# Altium project EvvGC v1.2.PrjPcb
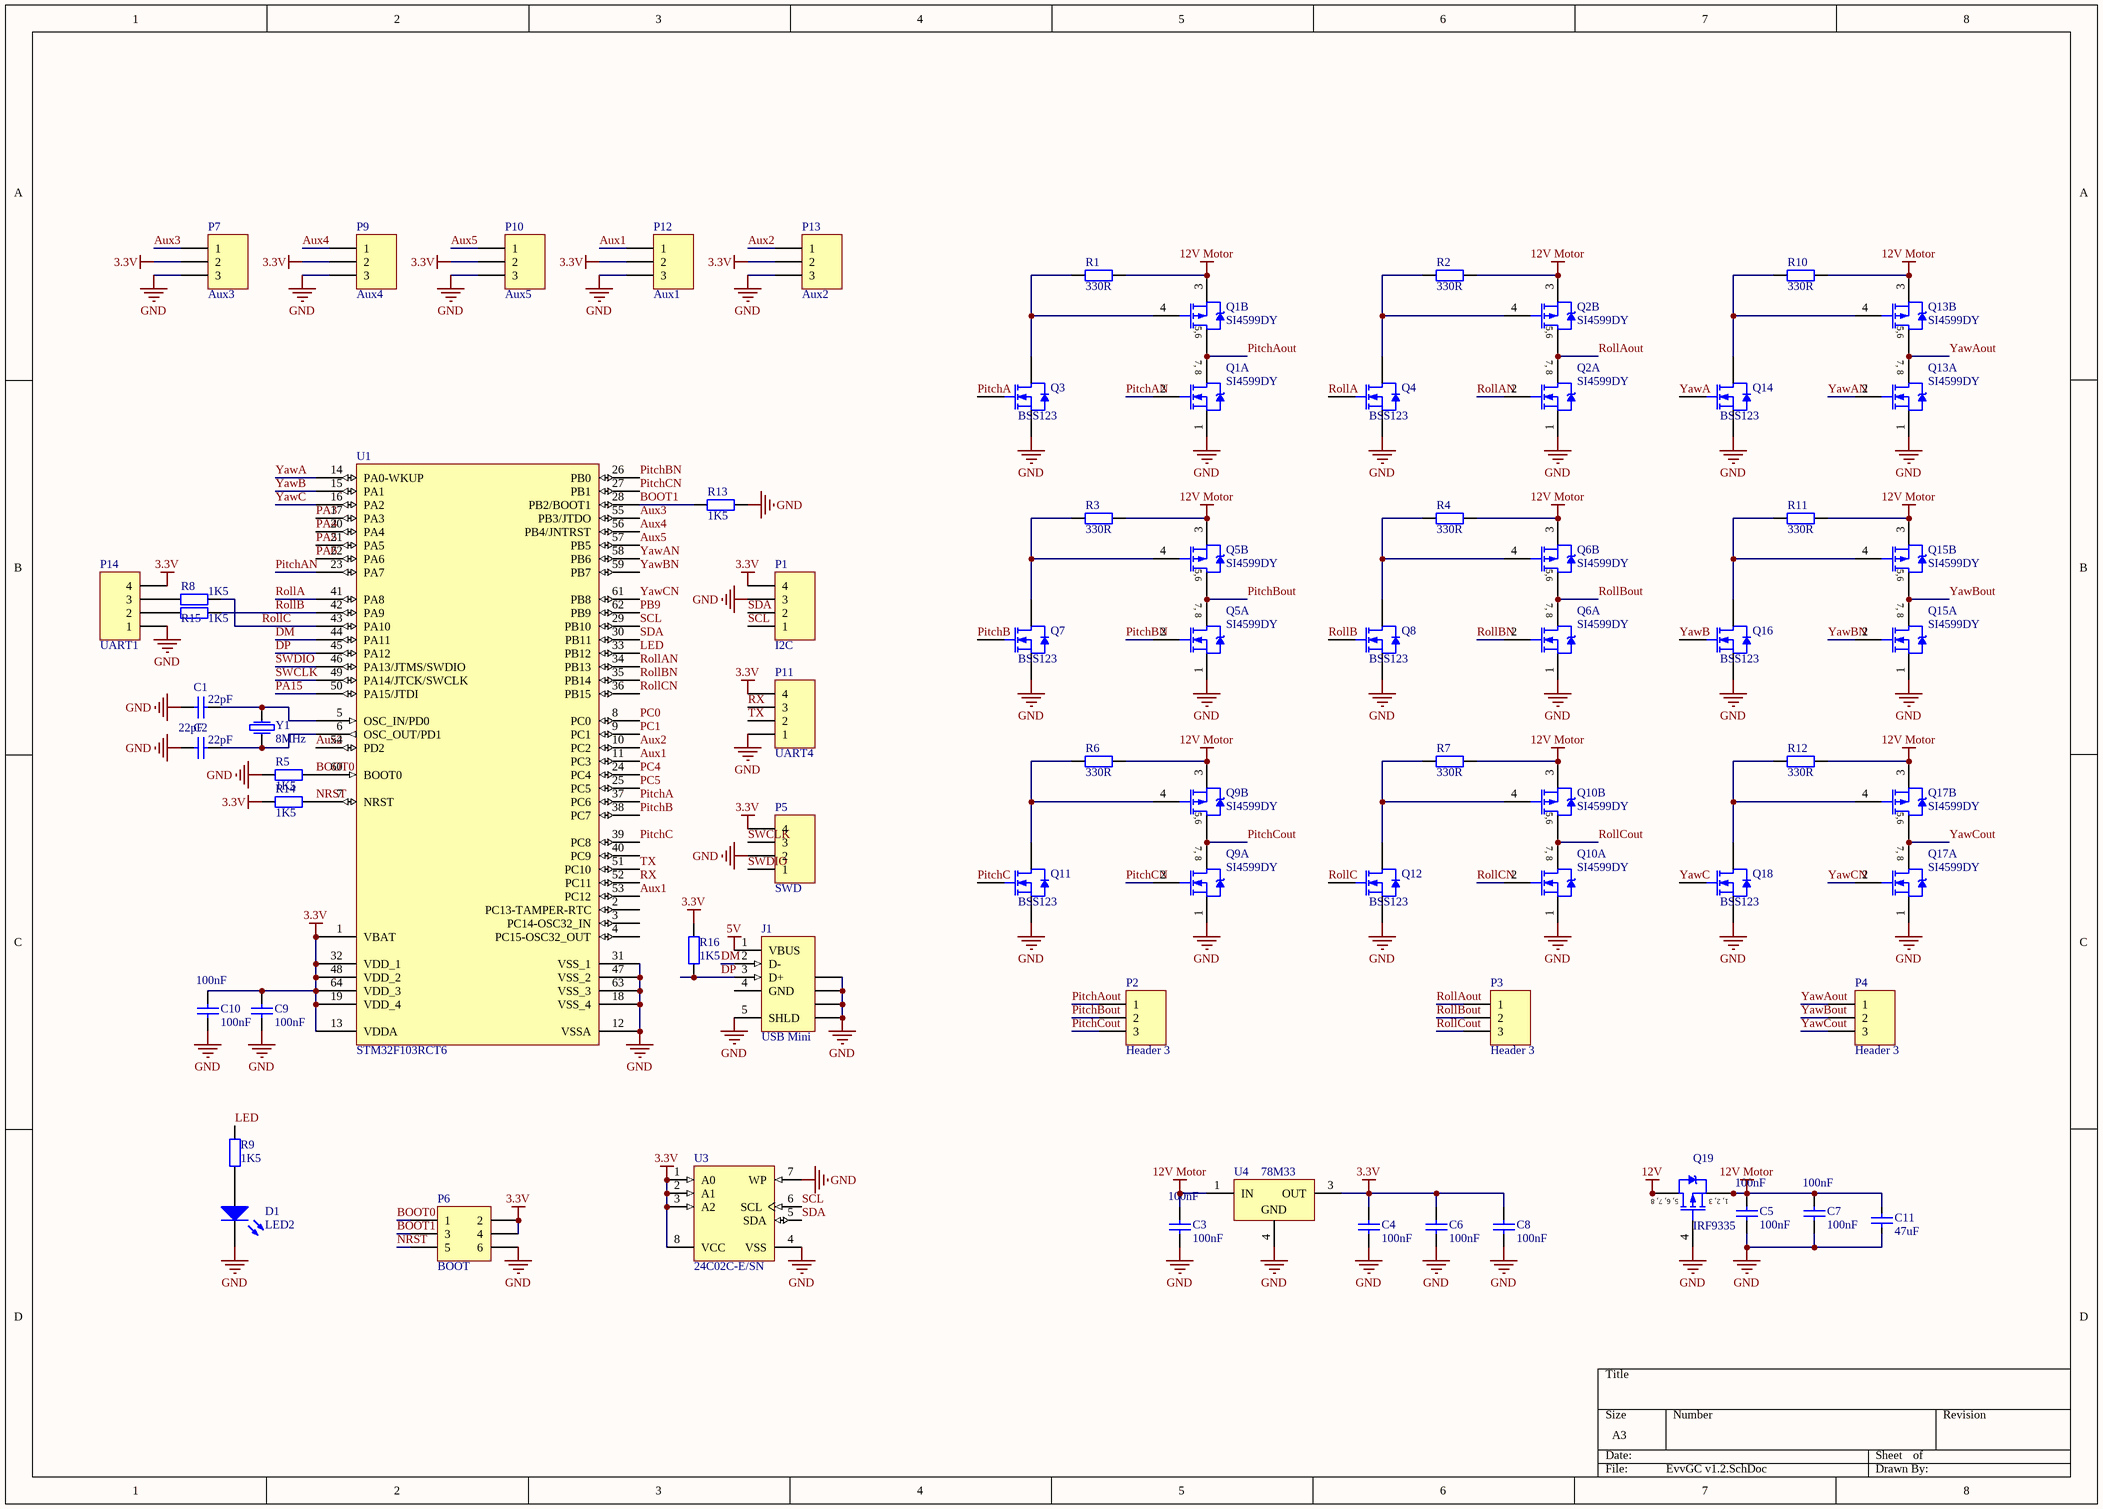
[diagram p0: EvvGC v1.2.SchDoc]
1 sheet, 65 parts. Net scope: global (net labels, ports and power ports of the same name join across sheets).
Board file: EvvGC v1.2.PcbDoc

## Sheet EvvGC v1.2.SchDoc
size A3

### Parts
C1  22pF  [CAPC2012L]
C2  22pF  [CAPC2012L]
C3  100nF  [CAPC2012L]
C4  100nF  [CAPC2012L]
C5  100nF  [CAPC2012L]
C6  100nF  [CAPC2012L]
C7  100nF  [CAPC2012L]
C8  100nF  [CAPC2012L]
C9  100nF  [CAPC2012L]
C10  100nF  [CAPC2012L]
C11  47uF  [TC6032-2412]
D1  LED2  [CAPC2012L]
J1  USB Mini  [440247]
P1  I2C  [HDR1X4]
P2  Header 3  [HDR1X3]
P3  Header 3  [HDR1X3]
P4  Header 3  [HDR1X3]
P5  SWD  [HDR1X4]
P6  BOOT  [HDR2X3]
P7  Aux3  [HDR1X3]
P9  Aux4  [HDR1X3]
P10  Aux5  [HDR1X3]
P11  UART4  [HDR1X4]
P12  Aux1  [HDR1X3]
P13  Aux2  [HDR1X3]
P14  UART1  [HDR1X4]
Q1  SI4599DY  [SO-8_N]  (parts A,B of 2)
Q2  SI4599DY  [SO-8_N]  (parts A,B of 2)
Q3  BSS123  [SOT23_N_EM]
Q4  BSS123  [SOT23_N_EM]
Q5  SI4599DY  [SO-8_N]  (parts A,B of 2)
Q6  SI4599DY  [SO-8_N]  (parts A,B of 2)
Q7  BSS123  [SOT23_N_EM]
Q8  BSS123  [SOT23_N_EM]
Q9  SI4599DY  [SO-8_N]  (parts A,B of 2)
Q10  SI4599DY  [SO-8_N]  (parts A,B of 2)
Q11  BSS123  [SOT23_N_EM]
Q12  BSS123  [SOT23_N_EM]
Q13  SI4599DY  [SO-8_N]  (parts A,B of 2)
Q14  BSS123  [SOT23_N_EM]
Q15  SI4599DY  [SO-8_N]  (parts A,B of 2)
Q16  BSS123  [SOT23_N_EM]
Q17  SI4599DY  [SO-8_N]  (parts A,B of 2)
Q18  BSS123  [SOT23_N_EM]
Q19  IRF9335  [SO-8_N]
R1  330R  [C0805]
R2  330R  [C0805]
R3  330R  [C0805]
R4  330R  [C0805]
R5  1K5  [RESC1608N]
R6  330R  [C0805]
R7  330R  [C0805]
R8  1K5  [RESC1608N]
R9  1K5  [RESC1608N]
R10  330R  [C0805]
R11  330R  [C0805]
R12  330R  [C0805]
R13  1K5  [RESC1608N]
R14  1K5  [RESC1608N]
R15  1K5  [RESC1608N]
R16  1K5  [RESC1608N]
U1  STM32F103RCT6  [LQFP64_N]
U3  24C02C-E/SN  [SOIC-SN8_N]
U4  78M33  [TO-252]
Y1  8MHz  [ABM3]

### Nets
3.3V: C4.1 C6.1 C8.1 C9.1 C10.1 P1.4 P5.4 P6.2 P6.4 P7.2 P9.2 P10.2 P11.4 P12.2 P13.2 P14.4 R14.2 R16.1 U1.1(VBAT) U1.13(VDDA) U1.19(VDD_4) U1.32(VDD_1) U1.48(VDD_2) U1.64(VDD_3) U3.1(A0) U3.2(A1) U3.3(A2) U3.8(VCC) U4.3(OUT)
5V: J1.1(VBUS)
12V: Q19.5(D) Q19.6(D) Q19.7(D) Q19.8(D)
12V Motor: C3.1 C5.1 C7.1 C11.2 Q1.3(S2) Q2.3(S2) Q5.3(S2) Q6.3(S2) Q9.3(S2) Q10.3(S2) Q13.3(S2) Q15.3(S2) Q17.3(S2) Q19.1(S) Q19.2(S) Q19.3(S) R1.2 R2.2 R3.2 R4.2 R6.2 R7.2 R10.2 R11.2 R12.2 U4.1(IN)
GND: C1.2 C2.2 C3.2 C4.2 C5.2 C6.2 C7.2 C8.2 C9.2 C10.2 C11.1 D1.2(K) J1.5(SHLD) J1.6(SHLD) J1.7(SHLD) J1.8(SHLD) J1.9(SHLD) P1.3 P5.2 P6.6 P7.3 P9.3 P10.3 P11.1 P12.3 P13.3 P14.1 Q1.1(S1) Q2.1(S1) Q3.2(S) Q4.2(S) Q5.1(S1) Q6.1(S1) Q7.2(S) Q8.2(S) Q9.1(S1) Q10.1(S1) Q11.2(S) Q12.2(S) Q13.1(S1) Q14.2(S) Q15.1(S1) Q16.2(S) Q17.1(S1) Q18.2(S) Q19.4(G) R5.2 R13.1 U1.12(VSSA) U1.18(VSS_4) U1.31(VSS_1) U1.47(VSS_2) U1.63(VSS_3) U3.4(VSS) U3.7(WP) U4.4(GND)
Aux1: P12.1 U1.11(PC3) U1.53(PC12)
Aux2: P13.1 U1.10(PC2) U1.54(PD2)
Aux3: P7.1 U1.55(PB3/JTDO)
Aux4: P9.1 U1.56(PB4/JNTRST)
Aux5: P10.1 U1.57(PB5)
BOOT0: P6.1 R5.1 U1.60(BOOT0)
BOOT1: P6.3 R13.2 U1.28(PB2/BOOT1)
DM: J1.2(D-) U1.44(PA11)
DP: J1.3(D+) R16.2 U1.45(PA12)
LED: R9.1 U1.33(PB12)
NRST: P6.5 R14.1 U1.7(NRST)
PA3: U1.17(PA3)
PA4: U1.20(PA4)
PA5: U1.21(PA5)
PA6: U1.22(PA6)
PA15: U1.50(PA15/JTDI)
PB9: U1.62(PB9)
PC0: U1.8(PC0)
PC1: U1.9(PC1)
PC4: U1.24(PC4)
PC5: U1.25(PC5)
PitchA: Q3.1(G) U1.37(PC6)
PitchAN: Q1.2(G1) U1.23(PA7)
PitchAout: P2.1 Q1.5(D2) Q1.6(D2) Q1.7(D1) Q1.8(D1)
PitchB: Q7.1(G) U1.38(PC7)
PitchBN: Q5.2(G1) U1.26(PB0)
PitchBout: P2.2 Q5.5(D2) Q5.6(D2) Q5.7(D1) Q5.8(D1)
PitchC: Q11.1(G) U1.39(PC8)
PitchCN: Q9.2(G1) U1.27(PB1)
PitchCout: P2.3 Q9.5(D2) Q9.6(D2) Q9.7(D1) Q9.8(D1)
RollA: Q4.1(G) U1.41(PA8)
RollAN: Q2.2(G1) U1.34(PB13)
RollAout: P3.1 Q2.5(D2) Q2.6(D2) Q2.7(D1) Q2.8(D1)
RollB: Q8.1(G) R15.1 U1.42(PA9)
RollBN: Q6.2(G1) U1.35(PB14)
RollBout: P3.2 Q6.5(D2) Q6.6(D2) Q6.7(D1) Q6.8(D1)
RollC: Q12.1(G) R8.1 U1.43(PA10)
RollCN: Q10.2(G1) U1.36(PB15)
RollCout: P3.3 Q10.5(D2) Q10.6(D2) Q10.7(D1) Q10.8(D1)
RX: P11.3 U1.52(PC11)
SCL: P1.1 U1.29(PB10) U3.6(SCL)
SDA: P1.2 U1.30(PB11) U3.5(SDA)
SWCLK: P5.3 U1.49(PA14/JTCK/SWCLK)
SWDIO: P5.1 U1.46(PA13/JTMS/SWDIO)
TX: P11.2 U1.51(PC10)
YawA: Q14.1(G) U1.14(PA0-WKUP)
YawAN: Q13.2(G1) U1.58(PB6)
YawAout: P4.1 Q13.5(D2) Q13.6(D2) Q13.7(D1) Q13.8(D1)
YawB: Q16.1(G) U1.15(PA1)
YawBN: Q15.2(G1) U1.59(PB7)
YawBout: P4.2 Q15.5(D2) Q15.6(D2) Q15.7(D1) Q15.8(D1)
YawC: Q18.1(G) U1.16(PA2)
YawCN: Q17.2(G1) U1.61(PB8)
YawCout: P4.3 Q17.5(D2) Q17.6(D2) Q17.7(D1) Q17.8(D1)
NetC1_1: C1.1 U1.5(OSC_IN/PD0) Y1.1
NetC2_1: C2.1 U1.6(OSC_OUT/PD1) Y1.2
NetD1_1: D1.1(A) R9.2
NetP14_2: P14.2 R15.2
NetP14_3: P14.3 R8.2
NetQ1_4: Q1.4(G2) Q3.3 R1.1
NetQ2_4: Q2.4(G2) Q4.3 R2.1
NetQ5_4: Q5.4(G2) Q7.3 R3.1
NetQ6_4: Q6.4(G2) Q8.3 R4.1
NetQ9_4: Q9.4(G2) Q11.3 R6.1
NetQ10_4: Q10.4(G2) Q12.3 R7.1
NetQ13_4: Q13.4(G2) Q14.3 R10.1
NetQ15_4: Q15.4(G2) Q16.3 R11.1
NetQ17_4: Q17.4(G2) Q18.3 R12.1

Not connected (* = marked no-connect by the designer): J1 4(GND); U1 2(PC13-TAMPER-RTC) 3(PC14-OSC32_IN) 4(PC15-OSC32_OUT) 40(PC9)

### Notes on the sheet
- (in symbol AUIRF7343, part A) 7, 8
- (in symbol AUIRF7343, part B) 5,6
- (in symbol IRF7404) 5, 6, 7, 8; 1, 2, 3

### Library data of the parts
C1-C10 = CAP0805: Capacitor; Published: 8-Jun-2000; LatestRevisionDate: 17-Jul-2002; LatestRevisionNote: Re-released for DXP Platform.; PackageReference: CAPC2012L; Publisher: Altium Limited
  C1 C2: Value: 22pF
  C3-C10: Value: 100nF
C11 = Cap: Capacitor; Published: 8-Jun-2000; LatestRevisionDate: 17-Jul-2002; LatestRevisionNote: Re-released for DXP Platform.; PackageReference: RAD-0.3; Publisher: Altium Limited; Value: 47uF
D1 = LED2: Typical RED, GREEN, YELLOW, AMBER GaAs LED; Published: 8-Jun-2000; LatestRevisionDate: 17-Jul-2002; LatestRevisionNote: Re-released for DXP Platform.; PackageVersion: Feb-2002; PackageReference: 3.2X1.6X1.1; Publisher: Altium Limited; PackageDescription: SM LED; 2 Flat Leads
J1 = 440247-2: USB 2.0, Right Angle, SMT, B Type, Receptacle, 5 Position, Black; Note: Directive 2000/53/EC (ELV) Compliant; ContactMaterial: Copper Alloy; ContactPlating: Gold (30); PCB_Layout: Complies with manufacturer's recommendation.; DrillSize: Corresponds to nominal value.; PanelGround: Without; Published: 15-Jul-2004; DatasheetDocument: 27-Jun-2003; PackageDocument: 27-Jun-2003; PackageReference: 440247; Publisher: Altium Limited; HousingMaterial: Thermoplastic; ComponentLink1Description: Manufacturer Link; ComponentLink1URL: http://www.tycoelectronics.com/; ComponentLink2Description: Packaging Specification; ComponentLink2URL: http://ecommas.tycoelectronics.com/commerce/DocumentDelivery/DDEController?Action=showdoc&DocId=Customer+Drawing%7F440247%7FD%7Fpdf%7FEnglish%7FC_440247_D.pdf
P1 P5 P11 P14 = Header 4: Header, 4-Pin; LatestRevisionDate: 17-Jul-2002; LatestRevisionNote: Re-released for DXP Platform.; Publisher: Altium Limited
P2-P4 P7 P9 P10 P12 P13 = Header 3: Header, 3-Pin; LatestRevisionDate: 17-Jul-2002; LatestRevisionNote: Re-released for DXP Platform.; Publisher: Altium Limited
P6 = Header 3X2: Header, 3-Pin, Dual row; LatestRevisionDate: 17-Jul-2002; LatestRevisionNote: Re-released for DXP Platform.; Publisher: Altium Limited
Q1 Q2 Q5 Q6 Q9 Q10 Q13 Q15 Q17 = AUIRF7343: HEXFET Power MOSFET; Published: 8-Jun-2000; LatestRevisionDate: 13-Apr-2006; DatasheetVersion: Aug-1997; PackageVersion: Feb-2001; PackageReference: SO-8; Publisher: Altium Limited; PackageDescription: 8-Pin Plastic Small Outline Integrated Circuit 1.27 mm Pitch; Code_JEDEC: MS-012-AA; Code_IPC: SOIC127P600-8; ComponentLink1Description: Manufacturer Link; ComponentLink1URL: http://www.irf.com/; ComponentLink2Description: Datasheet
Q3 Q4 Q7 Q8 Q11 Q12 Q14 Q16 Q18 = 2N7002: N-channel Enhancement Mode Field-effect Transistor; Published: 17-Sep-2003; LatestRevisionDate: 12-Dec-2006; LatestRevisionNote: IPC-7351 Footprint Added.; DatasheetVersion: 27-Jul-2000; PackageVersion: May-1999; PackageReference: SOT23; Publisher: Altium Limited; PackageDescription: 3-Pin SOT-23 Package 0.95 mm Pitch, 2.3 mm Lead Span; ComponentLink1Description: Manufacturer Link; ComponentLink1URL: http://www.semiconductors.philips.com/; ComponentLink2Description: Datasheet; ComponentLink2URL: http://www.semiconductors.philips.com/acrobat/datasheets/2N7002_4.pdf
Q19 = IRF7404: HEXFET Power MOSFET; Manufacturer: International Rectifier; Part Number: IRF9335PBF; Published: 8-Jun-2000; LatestRevisionDate: 13-Apr-2006; LatestRevisionNote: IPC-7351 Footprint Added.; DatasheetVersion: Mar-1999; PackageVersion: Feb-2001; PackageReference: SO-8; Publisher: Altium Limited; PackageDescription: 8-Pin Plastic Small Outline Integrated Circuit 1.27 mm Pitch; Code_JEDEC: MS-012-AA; Code_IPC: SOIC127P600-8; ComponentLink1Description: Manufacturer Link; ComponentLink1URL: http://www.irf.com/; ComponentLink2Description: Datasheet; ComponentLink2URL: http://www.irf.com/product-info/datasheets/data/irf7404.pdf
R1-R4 R6 R7 R10-R12 = Res: Resistor; Published: 8-Jun-2000; LatestRevisionDate: 17-Jul-2002; LatestRevisionNote: Re-released for DXP Platform.; PackageReference: AXIAL-0.4; Publisher: Altium Limited; PackageDescription: Axial Device, Thru-Hole; 2 Leads; 0.4 in Pin Spacing; Value: 330R
R5 R8 R9 R13-R16 = RES 0603 330R: RES 0603 1K5; Power W: 0.1W; Tolerance: ±5%; Resistance (Ohms): 1000; Category: Rasistors; Value: 1K5; Package / Case: 0603 (1608 Metric); Price 1k (Eur): 0.00231
U1 = STM32F103RBT6: STM32 ARM-based 32-bit MCU with 128 Kbytes Flash, 64-pin LQFP, Industrial Temperature; Published: 30-May-2008; DatasheetVersion: rev6, Mar-2008; PackageVersion: Mar-2008; PackageReference: LQFP64; Publisher: Altium Limited; PackageDescription: 64-Pin Low-Profile Quad Flat Pack, 10 x 10 mm Body, 0.5 mm Pitch (LQFP64); ComponentLink1Description: Manufacturer Link; ComponentLink1URL: www.st.com/stm32; ComponentLink2Description: Datasheet; ComponentLink2URL: http://www.st.com/stonline/products/literature/ds/13587.pdf
U3 = 24C02C-E/SN: 2Kbit, 400kHz, 5V, I2C Serial EEPROM, 8-Pin SOIC 150mil, Extended Temperature; Published: 29-Jan-2009; DatasheetVersion: revJ, Aug-2008; PackageVersion: revAW, Oct-2008; PackageReference: SOIC-SN8; Publisher: Altium Limited; PackageDescription: 8-Lead Plastic Small Outline (SN) - Narrow, 3.90mm Body [SOIC]; Code_JEDEC: MS-012; Code_IPC: SOIC127P600-8; ComponentLink1Description: Manufacturer Link; ComponentLink1URL: http://www.microchip.com; ComponentLink2Description: Datasheet; ComponentLink2URL: http://ww1.microchip.com/downloads/en/DeviceDoc/21202J.pdf; ComponentLink3Description: Packaging Specification; ComponentLink3URL: http://ww1.microchip.com/downloads/en/PackagingSpec/00049AW.pdf
U4 = L78M05CDT: Positive Voltage Regulator; Published: 24-Aug-2001; LatestRevisionDate: 06-Jun-2005; LatestRevisionNote: PCB pads lengthened.; DatasheetVersion: Apr-1994; PackageVersion: Jun-2004; PackageReference: TO-252; Publisher: Altium Limited; PackageDescription: D-PAK/TO-252-AA; 3 Leads (1 Cropped); Body 10.1 (inc. leads) x 6.6 mm (LxW max); ComponentLink1Description: Manufacturer Link; ComponentLink1URL: http://www.st.com/; ComponentLink2Description: Datasheet; ComponentLink2URL: http://www.st.com/stonline/products/literature/ds/2146/l78m05c.pdf
Y1 = CRYSTAL 16M SMD5x3.2mm: Manufacturer: ABRACON; Manufacturer Part Number: ABM3-16.000MHZ-B2-T; Value: 8MHz; Farnell Part Number: 1611806